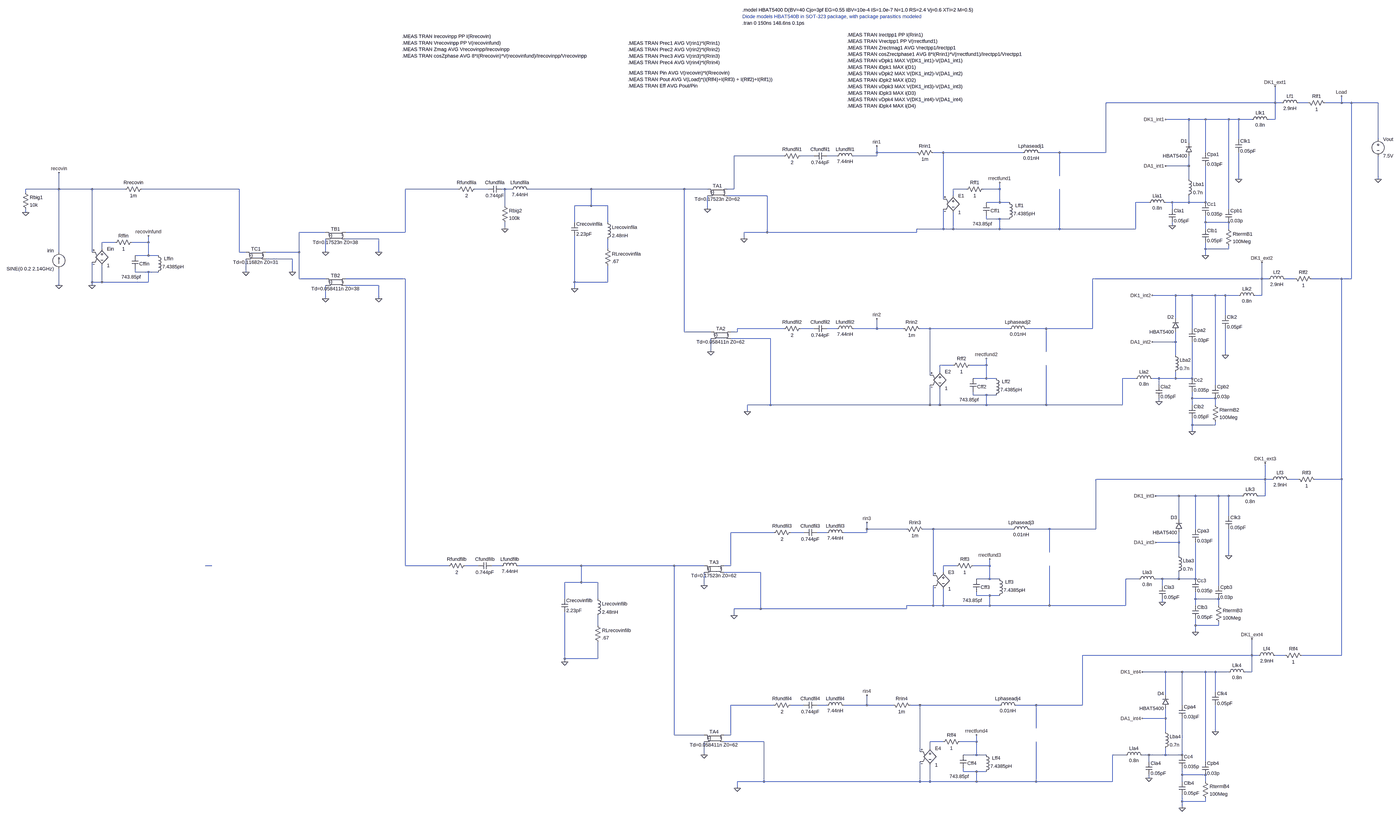
[diagram p0: schematic EnergyRecovery_TLRCN2stage_ResRec3_v2.asc, whole sheet]
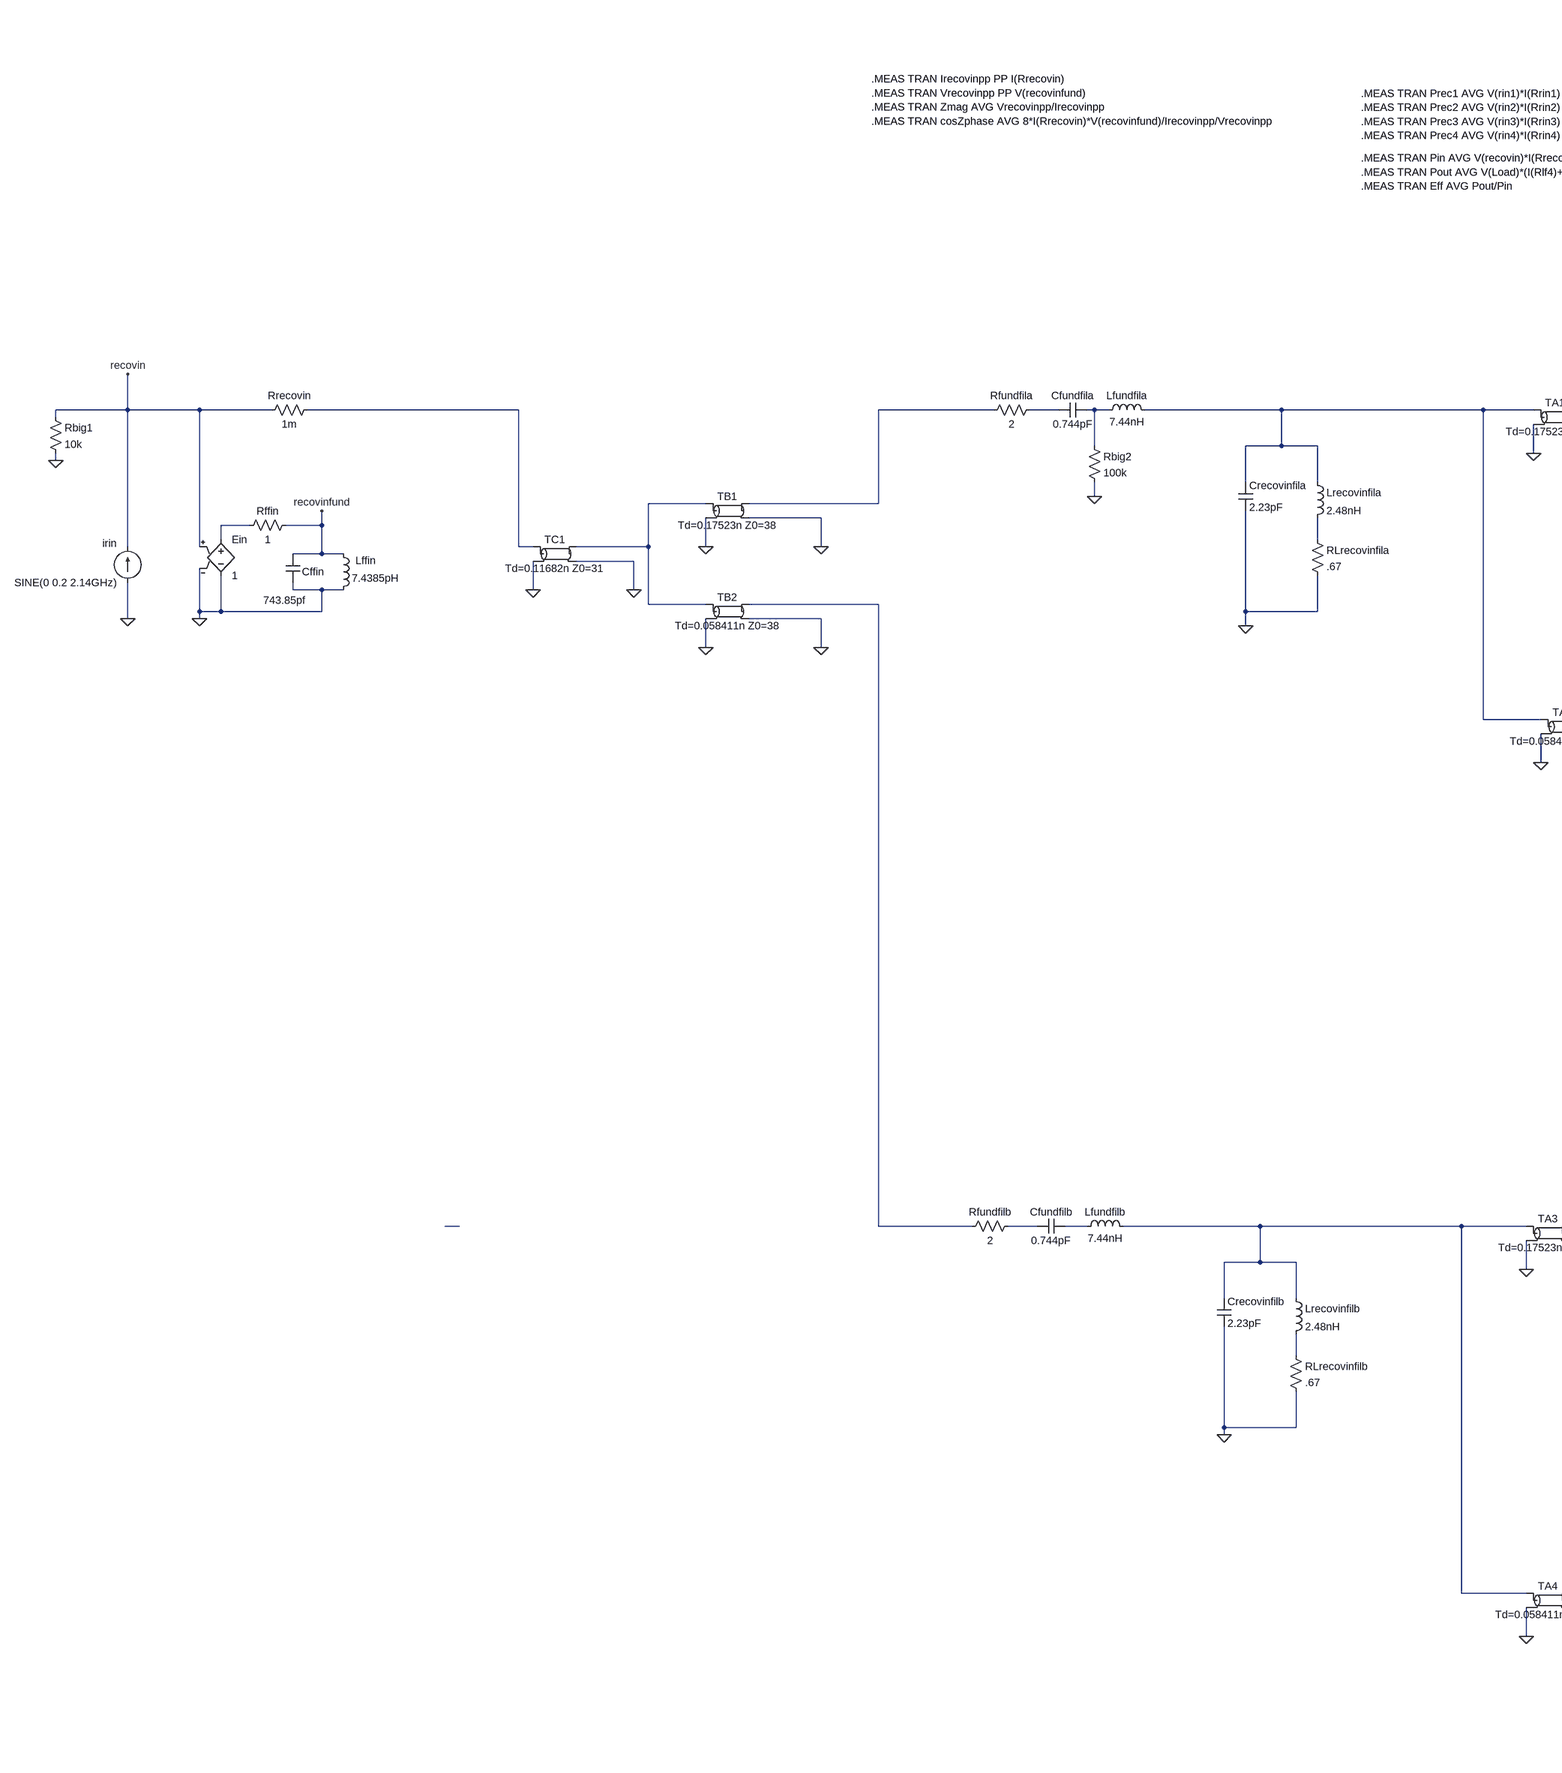
[diagram p1: schematic EnergyRecovery_TLRCN2stage_ResRec3_v2.asc, part, row 1 of 1, column 1 of 2]
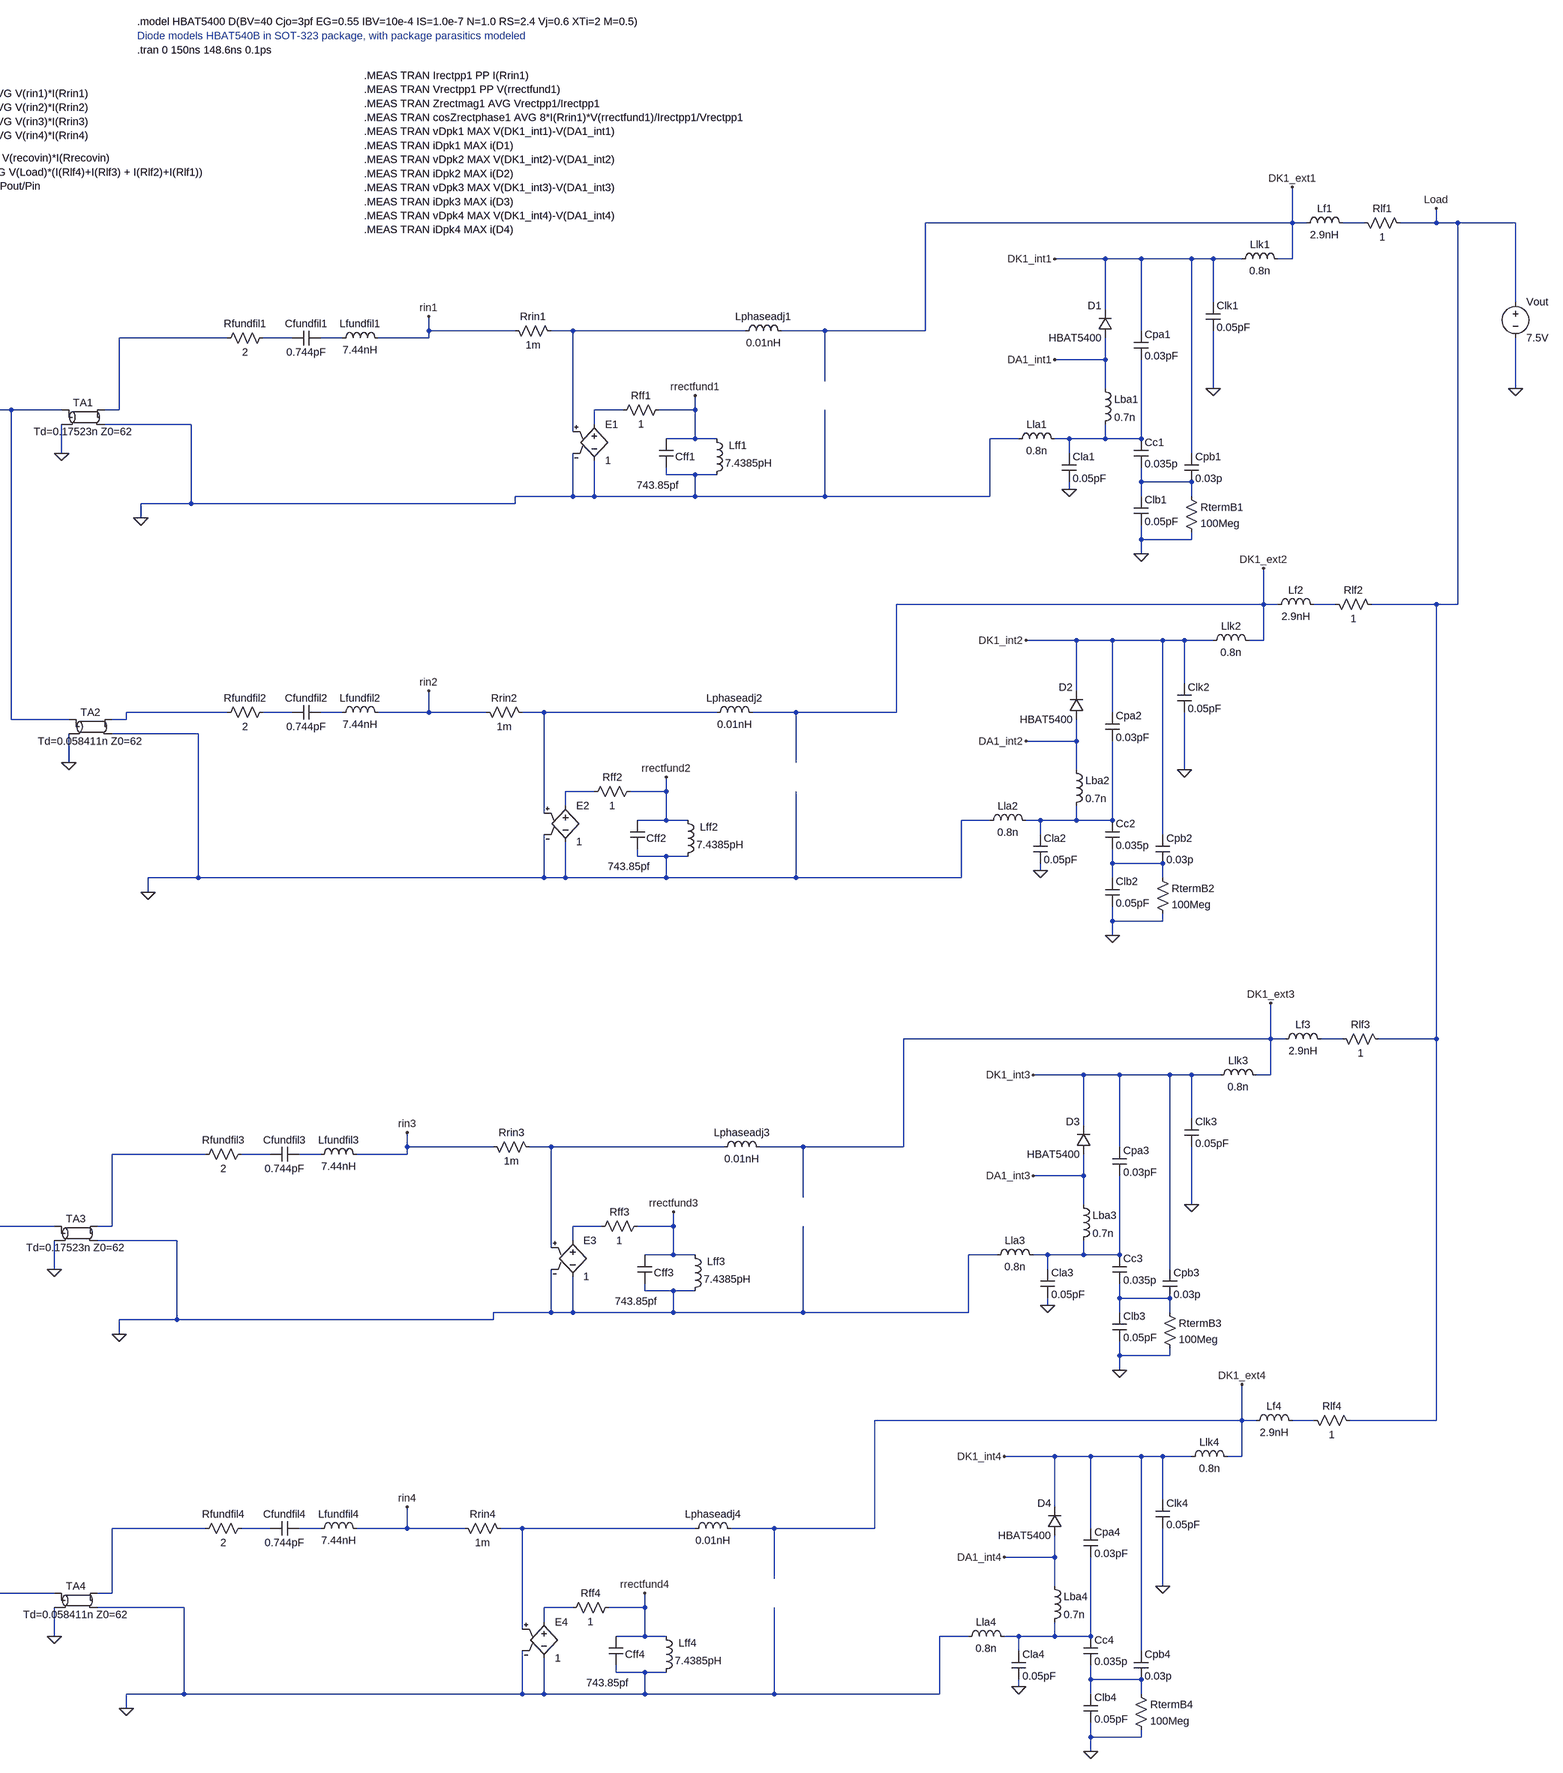
[diagram p2: schematic EnergyRecovery_TLRCN2stage_ResRec3_v2.asc, part, row 1 of 1, column 2 of 2]
EnergyRecovery_TLRCN2stage_ResRec3_v2.asc, the LTspice schematic file:
Version 4
SHEET 1 2288 2676
WIRE 1584 -784 1584 -864
WIRE 1584 -784 768 -784
WIRE 1616 -784 1584 -784
WIRE 1744 -784 1696 -784
WIRE 1904 -784 1904 -816
WIRE 1904 -784 1824 -784
WIRE 1952 -784 1904 -784
WIRE 2080 -784 1952 -784
WIRE 1168 -704 1056 -704
WIRE 1248 -704 1168 -704
WIRE 1360 -704 1248 -704
WIRE 1408 -704 1360 -704
WIRE 1472 -704 1408 -704
WIRE 1584 -704 1584 -784
WIRE 1584 -704 1552 -704
WIRE 1408 -608 1408 -704
WIRE 2080 -608 2080 -784
WIRE 1168 -592 1168 -704
WIRE -512 -544 -512 -576
WIRE -320 -544 -512 -544
WIRE -192 -544 -240 -544
WIRE 192 -544 -192 -544
WIRE 368 -544 272 -544
WIRE 768 -544 768 -784
WIRE 768 -544 368 -544
WIRE 1248 -544 1248 -704
WIRE -960 -528 -1200 -528
WIRE -816 -528 -880 -528
WIRE -704 -528 -752 -528
WIRE -512 -528 -512 -544
WIRE -512 -528 -624 -528
WIRE 1168 -480 1168 -528
WIRE 1168 -480 1056 -480
WIRE 368 -432 368 -544
WIRE 1168 -416 1168 -480
WIRE 1408 -416 1408 -544
WIRE 2080 -416 2080 -528
WIRE -4928 -368 -4928 -448
WIRE -4928 -368 -5088 -368
WIRE -4752 -368 -4928 -368
WIRE -4592 -368 -4752 -368
WIRE -3584 -368 -4512 -368
WIRE -2528 -368 -2784 -368
WIRE -2384 -368 -2448 -368
WIRE -2304 -368 -2320 -368
WIRE -2272 -368 -2304 -368
WIRE -1888 -368 -2192 -368
WIRE -1440 -368 -1888 -368
WIRE -1328 -368 -1440 -368
WIRE -1200 -368 -1200 -528
WIRE -1200 -368 -1232 -368
WIRE -80 -368 -144 -368
WIRE 80 -368 80 -400
WIRE 80 -368 0 -368
WIRE -5088 -352 -5088 -368
WIRE -1040 -336 -1232 -336
WIRE -144 -336 -144 -368
WIRE -192 -320 -192 -544
WIRE 80 -304 80 -368
WIRE 80 -304 16 -304
WIRE 128 -304 80 -304
WIRE 976 -304 912 -304
WIRE 1088 -304 1056 -304
WIRE 1168 -304 1168 -336
WIRE 1168 -304 1088 -304
WIRE 1248 -304 1248 -480
WIRE 1248 -304 1168 -304
WIRE -2304 -288 -2304 -368
WIRE -1888 -288 -1888 -368
WIRE -1888 -288 -1968 -288
WIRE -1808 -288 -1888 -288
WIRE -1328 -272 -1328 -336
WIRE 1088 -272 1088 -304
WIRE 1360 -272 1360 -704
WIRE -5088 -256 -5088 -272
WIRE 16 -224 16 -240
WIRE 80 -224 16 -224
WIRE 128 -224 80 -224
WIRE -1968 -208 -1968 -288
WIRE -1808 -208 -1808 -288
WIRE 1248 -208 1248 -240
WIRE 1360 -208 1248 -208
WIRE 1088 -192 1088 -208
WIRE -2304 -176 -2304 -208
WIRE -192 -176 -192 -272
WIRE -192 -176 -320 -176
WIRE -144 -176 -144 -256
WIRE -144 -176 -192 -176
WIRE 80 -176 80 -224
WIRE 80 -176 -144 -176
WIRE 368 -176 368 -368
WIRE 368 -176 80 -176
WIRE 912 -176 912 -304
WIRE 912 -176 368 -176
WIRE 1248 -176 1248 -208
WIRE 1360 -176 1360 -208
WIRE -3168 -160 -3296 -160
WIRE -2784 -160 -2784 -368
WIRE -2784 -160 -3072 -160
WIRE -1040 -160 -1040 -336
WIRE -1040 -160 -1152 -160
WIRE -320 -160 -320 -176
WIRE -320 -160 -1040 -160
WIRE -2912 -128 -3072 -128
WIRE -1152 -128 -1152 -160
WIRE -4640 -112 -4704 -112
WIRE -4480 -112 -4480 -144
WIRE -4480 -112 -4560 -112
WIRE -4704 -80 -4704 -112
WIRE -1808 -80 -1808 -128
WIRE 1248 -80 1248 -112
WIRE 1360 -80 1360 -96
WIRE 1360 -80 1248 -80
WIRE -4928 -64 -4928 -368
WIRE -4752 -64 -4752 -368
WIRE -3584 -64 -3584 -368
WIRE -3552 -64 -3584 -64
WIRE -3296 -64 -3296 -160
WIRE -3296 -64 -3456 -64
WIRE -3168 -64 -3168 -128
WIRE -2912 -64 -2912 -128
WIRE -4480 -48 -4480 -112
WIRE -4480 -48 -4544 -48
WIRE -4432 -48 -4480 -48
WIRE 1248 -48 1248 -80
WIRE -3328 -32 -3456 -32
WIRE -4544 32 -4544 16
WIRE -4480 32 -4544 32
WIRE -4432 32 -4480 32
WIRE -3552 32 -3552 -32
WIRE -3328 32 -3328 -32
WIRE -3296 64 -3296 -64
WIRE -3168 64 -3296 64
WIRE -2784 64 -3072 64
WIRE 1520 64 1520 -16
WIRE 1520 64 704 64
WIRE 1552 64 1520 64
WIRE 1680 64 1632 64
WIRE 1904 64 1760 64
WIRE 1952 64 1952 -784
WIRE 1952 64 1904 64
WIRE -4752 80 -4752 -16
WIRE -4704 80 -4704 0
WIRE -4704 80 -4752 80
WIRE -4480 80 -4480 32
WIRE -4480 80 -4704 80
WIRE -1968 80 -1968 -144
WIRE -1808 80 -1808 0
WIRE -1808 80 -1968 80
WIRE -4928 96 -4928 16
WIRE -4752 96 -4752 80
WIRE -2912 96 -3072 96
WIRE -1968 112 -1968 80
WIRE 1104 144 992 144
WIRE 1184 144 1104 144
WIRE 1296 144 1184 144
WIRE 1344 144 1296 144
WIRE 1408 144 1344 144
WIRE 1520 144 1520 64
WIRE 1520 144 1488 144
WIRE -3168 160 -3168 96
WIRE -2912 160 -2912 96
WIRE 1344 240 1344 144
WIRE 1104 256 1104 144
WIRE -960 304 -1184 304
WIRE -816 304 -880 304
WIRE -704 304 -752 304
WIRE -512 304 -512 256
WIRE -512 304 -624 304
WIRE -384 304 -512 304
WIRE -256 304 -304 304
WIRE 128 304 -256 304
WIRE 304 304 208 304
WIRE 704 304 704 64
WIRE 704 304 304 304
WIRE 1184 304 1184 144
WIRE -1440 320 -1440 -368
WIRE -1312 320 -1440 320
WIRE -1184 320 -1184 304
WIRE -1184 320 -1216 320
WIRE -1024 352 -1216 352
WIRE 1104 368 1104 320
WIRE 1104 368 992 368
WIRE -1312 416 -1312 352
WIRE 304 416 304 304
WIRE 1104 432 1104 368
WIRE 1344 432 1344 304
WIRE -144 480 -208 480
WIRE 16 480 16 448
WIRE 16 480 -64 480
WIRE -208 512 -208 480
WIRE -256 528 -256 304
WIRE 16 544 16 480
WIRE 16 544 -48 544
WIRE 64 544 16 544
WIRE 912 544 848 544
WIRE 1024 544 992 544
WIRE 1104 544 1104 512
WIRE 1104 544 1024 544
WIRE 1184 544 1184 368
WIRE 1184 544 1104 544
WIRE 1024 576 1024 544
WIRE 1296 576 1296 144
WIRE -48 624 -48 608
WIRE 16 624 -48 624
WIRE 64 624 16 624
WIRE 1184 640 1184 608
WIRE 1296 640 1184 640
WIRE 1024 656 1024 640
WIRE -1024 672 -1024 352
WIRE -1024 672 -1136 672
WIRE -256 672 -256 576
WIRE -256 672 -1024 672
WIRE -208 672 -208 592
WIRE -208 672 -256 672
WIRE 16 672 16 624
WIRE 16 672 -208 672
WIRE 304 672 304 480
WIRE 304 672 16 672
WIRE 848 672 848 544
WIRE 848 672 304 672
WIRE 1184 672 1184 640
WIRE 1296 672 1296 640
WIRE -1136 704 -1136 672
WIRE 1184 768 1184 736
WIRE 1296 768 1296 752
WIRE 1296 768 1184 768
WIRE 1184 800 1184 768
WIRE 1536 1072 1536 992
WIRE 1536 1072 720 1072
WIRE 1568 1072 1536 1072
WIRE 1696 1072 1648 1072
WIRE 1904 1072 1904 64
WIRE 1904 1072 1776 1072
WIRE 1120 1152 1008 1152
WIRE 1200 1152 1120 1152
WIRE 1312 1152 1200 1152
WIRE 1360 1152 1312 1152
WIRE 1424 1152 1360 1152
WIRE 1536 1152 1536 1072
WIRE 1536 1152 1504 1152
WIRE 1360 1248 1360 1152
WIRE 1120 1264 1120 1152
WIRE -560 1312 -560 1280
WIRE -368 1312 -560 1312
WIRE -240 1312 -288 1312
WIRE 144 1312 -240 1312
WIRE 320 1312 224 1312
WIRE 720 1312 720 1072
WIRE 720 1312 320 1312
WIRE 1200 1312 1200 1152
WIRE -1008 1328 -1216 1328
WIRE -864 1328 -928 1328
WIRE -752 1328 -800 1328
WIRE -560 1328 -560 1312
WIRE -560 1328 -672 1328
WIRE 1120 1376 1120 1328
WIRE 1120 1376 1008 1376
WIRE 320 1424 320 1312
WIRE 1120 1440 1120 1376
WIRE 1360 1440 1360 1312
WIRE -4096 1488 -4128 1488
WIRE -2784 1488 -2784 64
WIRE -2576 1488 -2784 1488
WIRE -2432 1488 -2496 1488
WIRE -2320 1488 -2368 1488
WIRE -1936 1488 -2240 1488
WIRE -1488 1488 -1936 1488
WIRE -1344 1488 -1488 1488
WIRE -1216 1488 -1216 1328
WIRE -1216 1488 -1248 1488
WIRE -128 1488 -192 1488
WIRE 32 1488 32 1456
WIRE 32 1488 -48 1488
WIRE -1072 1520 -1248 1520
WIRE -192 1520 -192 1488
WIRE -240 1536 -240 1312
WIRE 32 1552 32 1488
WIRE 32 1552 -32 1552
WIRE 80 1552 32 1552
WIRE 928 1552 864 1552
WIRE 1040 1552 1008 1552
WIRE 1120 1552 1120 1520
WIRE 1120 1552 1040 1552
WIRE 1200 1552 1200 1376
WIRE 1200 1552 1120 1552
WIRE -1936 1568 -1936 1488
WIRE -1936 1568 -2016 1568
WIRE -1856 1568 -1936 1568
WIRE -1344 1584 -1344 1520
WIRE 1040 1584 1040 1552
WIRE 1312 1584 1312 1152
WIRE -32 1632 -32 1616
WIRE 32 1632 -32 1632
WIRE 80 1632 32 1632
WIRE -2016 1648 -2016 1568
WIRE -1856 1648 -1856 1568
WIRE 1200 1648 1200 1616
WIRE 1312 1648 1200 1648
WIRE 1040 1664 1040 1648
WIRE -240 1680 -240 1584
WIRE -240 1680 -368 1680
WIRE -192 1680 -192 1600
WIRE -192 1680 -240 1680
WIRE 32 1680 32 1632
WIRE 32 1680 -192 1680
WIRE 320 1680 320 1488
WIRE 320 1680 32 1680
WIRE 864 1680 864 1552
WIRE 864 1680 320 1680
WIRE 1200 1680 1200 1648
WIRE 1312 1680 1312 1648
WIRE -1072 1696 -1072 1520
WIRE -1072 1696 -1200 1696
WIRE -368 1696 -368 1680
WIRE -368 1696 -1072 1696
WIRE -1200 1728 -1200 1696
WIRE -1856 1776 -1856 1728
WIRE 1200 1776 1200 1744
WIRE 1312 1776 1312 1760
WIRE 1312 1776 1200 1776
WIRE 1200 1808 1200 1776
WIRE 1472 1920 1472 1840
WIRE 1472 1920 656 1920
WIRE 1504 1920 1472 1920
WIRE 1632 1920 1584 1920
WIRE 1904 1920 1904 1072
WIRE 1904 1920 1712 1920
WIRE -2016 1936 -2016 1712
WIRE -1856 1936 -1856 1856
WIRE -1856 1936 -2016 1936
WIRE -2016 1952 -2016 1936
WIRE 1056 2000 944 2000
WIRE 1136 2000 1056 2000
WIRE 1248 2000 1136 2000
WIRE 1296 2000 1248 2000
WIRE 1360 2000 1296 2000
WIRE 1472 2000 1472 1920
WIRE 1472 2000 1440 2000
WIRE 1296 2096 1296 2000
WIRE 1056 2112 1056 2000
WIRE -1008 2160 -1216 2160
WIRE -864 2160 -928 2160
WIRE -752 2160 -800 2160
WIRE -560 2160 -560 2112
WIRE -560 2160 -672 2160
WIRE -432 2160 -560 2160
WIRE -304 2160 -352 2160
WIRE 80 2160 -304 2160
WIRE 256 2160 160 2160
WIRE 656 2160 656 1920
WIRE 656 2160 256 2160
WIRE 1136 2160 1136 2000
WIRE 1056 2224 1056 2176
WIRE 1056 2224 944 2224
WIRE 256 2272 256 2160
WIRE 1056 2288 1056 2224
WIRE 1296 2288 1296 2160
WIRE -1488 2304 -1488 1488
WIRE -1344 2304 -1488 2304
WIRE -1216 2304 -1216 2160
WIRE -1216 2304 -1248 2304
WIRE -1056 2336 -1248 2336
WIRE -192 2336 -256 2336
WIRE -32 2336 -32 2304
WIRE -32 2336 -112 2336
WIRE -256 2368 -256 2336
WIRE -304 2384 -304 2160
WIRE -1344 2400 -1344 2336
WIRE -32 2400 -32 2336
WIRE -32 2400 -96 2400
WIRE 16 2400 -32 2400
WIRE 864 2400 800 2400
WIRE 976 2400 944 2400
WIRE 1056 2400 1056 2368
WIRE 1056 2400 976 2400
WIRE 1136 2400 1136 2224
WIRE 1136 2400 1056 2400
WIRE 976 2432 976 2400
WIRE 1248 2432 1248 2000
WIRE -96 2480 -96 2464
WIRE -32 2480 -96 2480
WIRE 16 2480 -32 2480
WIRE 1136 2496 1136 2464
WIRE 1248 2496 1136 2496
WIRE 976 2512 976 2496
WIRE -1056 2528 -1056 2336
WIRE -1056 2528 -1184 2528
WIRE -304 2528 -304 2432
WIRE -304 2528 -1056 2528
WIRE -256 2528 -256 2448
WIRE -256 2528 -304 2528
WIRE -32 2528 -32 2480
WIRE -32 2528 -256 2528
WIRE 256 2528 256 2336
WIRE 256 2528 -32 2528
WIRE 800 2528 800 2400
WIRE 800 2528 256 2528
WIRE 1136 2528 1136 2496
WIRE 1248 2528 1248 2496
WIRE -1184 2560 -1184 2528
WIRE 1136 2624 1136 2592
WIRE 1248 2624 1248 2608
WIRE 1248 2624 1136 2624
WIRE 1136 2656 1136 2624
FLAG -4928 96 0
FLAG -4928 -448 recovin
FLAG -4480 -144 recovinfund
FLAG -4752 96 0
FLAG 1056 -704 DK1_int1
FLAG 1904 -816 Load
FLAG 80 -400 rrectfund1
FLAG 1408 -416 0
FLAG 1088 -192 0
FLAG 1248 -48 0
FLAG 1056 -480 DA1_int1
FLAG 1584 -864 DK1_ext1
FLAG 2080 -416 0
FLAG 992 144 DK1_int2
FLAG 16 448 rrectfund2
FLAG 1344 432 0
FLAG 1024 656 0
FLAG 1184 800 0
FLAG 992 368 DA1_int2
FLAG 1520 -16 DK1_ext2
FLAG -1152 -128 0
FLAG -1136 704 0
FLAG -512 -576 rin1
FLAG -512 256 rin2
FLAG 1008 1152 DK1_int3
FLAG 32 1456 rrectfund3
FLAG 1360 1440 0
FLAG 1040 1664 0
FLAG 1200 1808 0
FLAG 1008 1376 DA1_int3
FLAG 1536 992 DK1_ext3
FLAG 944 2000 DK1_int4
FLAG -32 2304 rrectfund4
FLAG 1296 2288 0
FLAG 976 2512 0
FLAG 1136 2656 0
FLAG 944 2224 DA1_int4
FLAG 1472 1840 DK1_ext4
FLAG -1200 1728 0
FLAG -1184 2560 0
FLAG -560 1280 rin3
FLAG -560 2112 rin4
FLAG -2016 1952 0
FLAG -1968 112 0
FLAG -5088 -256 0
FLAG -2304 -176 0
FLAG -1328 -272 0
FLAG -1312 416 0
FLAG -1344 1584 0
FLAG -1344 2400 0
FLAG -3168 -64 0
FLAG -3168 160 0
FLAG -2912 -64 0
FLAG -2912 160 0
FLAG -3328 32 0
FLAG -3552 32 0
SYMBOL current -4928 16 R180
WINDOW 0 24 88 Left 0
WINDOW 3 24 0 Left 0
WINDOW 123 0 0 Left 0
WINDOW 39 0 0 Left 0
SYMATTR InstName irin
SYMATTR Value SINE(0 0.2 2.14GHz)
SYMBOL ind -720 320 R270
WINDOW 0 32 56 VTop 0
WINDOW 3 5 56 VBottom 0
SYMATTR InstName Lfundfil2
SYMATTR Value 7.44nH
SYMBOL cap -752 288 R90
WINDOW 0 0 32 VBottom 0
WINDOW 3 32 32 VTop 0
SYMATTR InstName Cfundfil2
SYMATTR Value 0.744pF
SYMBOL res -864 288 R90
WINDOW 0 0 56 VBottom 0
WINDOW 3 32 56 VTop 0
SYMATTR InstName Rfundfil2
SYMATTR Value 2
SYMBOL ind -720 -512 R270
WINDOW 0 32 56 VTop 0
WINDOW 3 5 56 VBottom 0
SYMATTR InstName Lfundfil1
SYMATTR Value 7.44nH
SYMBOL cap -752 -544 R90
WINDOW 0 0 32 VBottom 0
WINDOW 3 32 32 VTop 0
SYMATTR InstName Cfundfil1
SYMATTR Value 0.744pF
SYMBOL res -864 -544 R90
WINDOW 0 0 56 VBottom 0
WINDOW 3 32 56 VTop 0
SYMATTR InstName Rfundfil1
SYMATTR Value 2
SYMBOL res -4608 -352 R270
WINDOW 0 32 56 VTop 0
WINDOW 3 0 56 VBottom 0
SYMATTR InstName Rrecovin
SYMATTR Value 1m
SYMBOL cap -4560 -48 R0
WINDOW 0 36 40 Left 0
WINDOW 3 -50 103 Left 0
SYMATTR InstName Cffin
SYMATTR Value 743.85pf
SYMBOL ind -4448 -64 R0
WINDOW 0 43 31 Left 0
WINDOW 3 35 70 Left 0
SYMATTR InstName Lffin
SYMATTR Value 7.4385pH
SYMBOL e -4704 -96 R0
SYMATTR InstName Ein
SYMATTR Value 1
SYMBOL res -4544 -128 R90
WINDOW 0 0 56 VBottom 0
WINDOW 3 32 56 VTop 0
SYMATTR InstName Rffin
SYMATTR Value 1
SYMBOL cap -1984 -208 R0
SYMATTR InstName Crecovinfila
SYMATTR Value 2.23pF
SYMBOL ind -1824 -224 R0
SYMATTR InstName Lrecovinfila
SYMATTR Value 2.48nH
SYMBOL res -1824 -96 R0
SYMATTR InstName RLrecovinfila
SYMATTR Value .67
SYMBOL cap 1232 -544 R0
SYMATTR InstName Cpa1
SYMATTR Value 0.03pF
SYMBOL cap 1392 -608 R0
SYMATTR InstName Clk1
SYMATTR Value 0.05pF
SYMBOL ind 1600 -768 R270
WINDOW 0 32 56 VTop 0
WINDOW 3 5 56 VBottom 0
SYMATTR InstName Lf1
SYMATTR Value 2.9nH
SYMBOL res 1728 -800 M90
WINDOW 0 0 56 VBottom 0
WINDOW 3 32 56 VTop 0
SYMATTR InstName Rlf1
SYMATTR Value 1
SYMBOL cap 0 -304 R0
WINDOW 0 36 40 Left 0
WINDOW 3 -50 103 Left 0
SYMATTR InstName Cff1
SYMATTR Value 743.85pf
SYMBOL ind 112 -320 R0
WINDOW 0 43 31 Left 0
WINDOW 3 35 70 Left 0
SYMATTR InstName Lff1
SYMATTR Value 7.4385pH
SYMBOL e -144 -352 R0
SYMATTR InstName E1
SYMATTR Value 1
SYMBOL res 16 -384 R90
WINDOW 0 0 56 VBottom 0
WINDOW 3 32 56 VTop 0
SYMATTR InstName Rff1
SYMATTR Value 1
SYMBOL voltage 2080 -624 R0
SYMATTR InstName Vout
SYMATTR Value 7.5V
SYMBOL res -336 -560 M90
WINDOW 0 0 56 VBottom 0
WINDOW 3 32 56 VTop 0
SYMATTR InstName Rrin1
SYMATTR Value 1m
SYMBOL ind 176 -528 R270
WINDOW 0 32 56 VTop 0
WINDOW 3 5 56 VBottom 0
SYMATTR InstName Lphaseadj1
SYMATTR Value 0.01nH
SYMBOL diode 1184 -528 R180
WINDOW 0 24 72 Left 0
WINDOW 3 24 0 Left 0
SYMATTR InstName D1
SYMATTR Value HBAT5400
SYMBOL ind 1152 -432 R0
SYMATTR InstName Lba1
SYMATTR Value 0.7n
SYMBOL ind 1456 -688 R270
WINDOW 0 32 56 VTop 0
WINDOW 3 5 56 VBottom 0
SYMATTR InstName Llk1
SYMATTR Value 0.8n
SYMBOL cap 1072 -272 R0
SYMATTR InstName Cla1
SYMATTR Value 0.05pF
SYMBOL cap 1232 -304 R0
SYMATTR InstName Cc1
SYMATTR Value 0.035p
SYMBOL cap 1232 -176 R0
SYMATTR InstName Clb1
SYMATTR Value 0.05pF
SYMBOL cap 1344 -272 R0
SYMATTR InstName Cpb1
SYMATTR Value 0.03p
SYMBOL ind 960 -288 R270
WINDOW 0 32 56 VTop 0
WINDOW 3 5 56 VBottom 0
SYMATTR InstName Lla1
SYMATTR Value 0.8n
SYMBOL res 1344 -192 R0
SYMATTR InstName RtermB1
SYMATTR Value 100Meg
SYMBOL cap 1168 304 R0
SYMATTR InstName Cpa2
SYMATTR Value 0.03pF
SYMBOL cap 1328 240 R0
SYMATTR InstName Clk2
SYMATTR Value 0.05pF
SYMBOL ind 1536 80 R270
WINDOW 0 32 56 VTop 0
WINDOW 3 5 56 VBottom 0
SYMATTR InstName Lf2
SYMATTR Value 2.9nH
SYMBOL res 1664 48 M90
WINDOW 0 0 56 VBottom 0
WINDOW 3 32 56 VTop 0
SYMATTR InstName Rlf2
SYMATTR Value 1
SYMBOL cap -64 544 R0
WINDOW 0 36 40 Left 0
WINDOW 3 -50 103 Left 0
SYMATTR InstName Cff2
SYMATTR Value 743.85pf
SYMBOL ind 48 528 R0
WINDOW 0 43 31 Left 0
WINDOW 3 35 70 Left 0
SYMATTR InstName Lff2
SYMATTR Value 7.4385pH
SYMBOL e -208 496 R0
SYMATTR InstName E2
SYMATTR Value 1
SYMBOL res -48 464 R90
WINDOW 0 0 56 VBottom 0
WINDOW 3 32 56 VTop 0
SYMATTR InstName Rff2
SYMATTR Value 1
SYMBOL res -400 288 M90
WINDOW 0 0 56 VBottom 0
WINDOW 3 32 56 VTop 0
SYMATTR InstName Rrin2
SYMATTR Value 1m
SYMBOL ind 112 320 R270
WINDOW 0 32 56 VTop 0
WINDOW 3 5 56 VBottom 0
SYMATTR InstName Lphaseadj2
SYMATTR Value 0.01nH
SYMBOL diode 1120 320 R180
WINDOW 0 24 72 Left 0
WINDOW 3 24 0 Left 0
SYMATTR InstName D2
SYMATTR Value HBAT5400
SYMBOL ind 1088 416 R0
SYMATTR InstName Lba2
SYMATTR Value 0.7n
SYMBOL ind 1392 160 R270
WINDOW 0 32 56 VTop 0
WINDOW 3 5 56 VBottom 0
SYMATTR InstName Llk2
SYMATTR Value 0.8n
SYMBOL cap 1008 576 R0
SYMATTR InstName Cla2
SYMATTR Value 0.05pF
SYMBOL cap 1168 544 R0
SYMATTR InstName Cc2
SYMATTR Value 0.035p
SYMBOL cap 1168 672 R0
SYMATTR InstName Clb2
SYMATTR Value 0.05pF
SYMBOL cap 1280 576 R0
SYMATTR InstName Cpb2
SYMATTR Value 0.03p
SYMBOL ind 896 560 R270
WINDOW 0 32 56 VTop 0
WINDOW 3 5 56 VBottom 0
SYMATTR InstName Lla2
SYMATTR Value 0.8n
SYMBOL res 1280 656 R0
SYMATTR InstName RtermB2
SYMATTR Value 100Meg
SYMBOL ind -768 2176 R270
WINDOW 0 32 56 VTop 0
WINDOW 3 5 56 VBottom 0
SYMATTR InstName Lfundfil4
SYMATTR Value 7.44nH
SYMBOL cap -800 2144 R90
WINDOW 0 0 32 VBottom 0
WINDOW 3 32 32 VTop 0
SYMATTR InstName Cfundfil4
SYMATTR Value 0.744pF
SYMBOL res -912 2144 R90
WINDOW 0 0 56 VBottom 0
WINDOW 3 32 56 VTop 0
SYMATTR InstName Rfundfil4
SYMATTR Value 2
SYMBOL ind -768 1344 R270
WINDOW 0 32 56 VTop 0
WINDOW 3 5 56 VBottom 0
SYMATTR InstName Lfundfil3
SYMATTR Value 7.44nH
SYMBOL cap -800 1312 R90
WINDOW 0 0 32 VBottom 0
WINDOW 3 32 32 VTop 0
SYMATTR InstName Cfundfil3
SYMATTR Value 0.744pF
SYMBOL res -912 1312 R90
WINDOW 0 0 56 VBottom 0
WINDOW 3 32 56 VTop 0
SYMATTR InstName Rfundfil3
SYMATTR Value 2
SYMBOL cap 1184 1312 R0
SYMATTR InstName Cpa3
SYMATTR Value 0.03pF
SYMBOL cap 1344 1248 R0
SYMATTR InstName Clk3
SYMATTR Value 0.05pF
SYMBOL ind 1552 1088 R270
WINDOW 0 32 56 VTop 0
WINDOW 3 5 56 VBottom 0
SYMATTR InstName Lf3
SYMATTR Value 2.9nH
SYMBOL res 1680 1056 M90
WINDOW 0 0 56 VBottom 0
WINDOW 3 32 56 VTop 0
SYMATTR InstName Rlf3
SYMATTR Value 1
SYMBOL cap -48 1552 R0
WINDOW 0 36 40 Left 0
WINDOW 3 -50 103 Left 0
SYMATTR InstName Cff3
SYMATTR Value 743.85pf
SYMBOL ind 64 1536 R0
WINDOW 0 43 31 Left 0
WINDOW 3 35 70 Left 0
SYMATTR InstName Lff3
SYMATTR Value 7.4385pH
SYMBOL e -192 1504 R0
SYMATTR InstName E3
SYMATTR Value 1
SYMBOL res -32 1472 R90
WINDOW 0 0 56 VBottom 0
WINDOW 3 32 56 VTop 0
SYMATTR InstName Rff3
SYMATTR Value 1
SYMBOL res -384 1296 M90
WINDOW 0 0 56 VBottom 0
WINDOW 3 32 56 VTop 0
SYMATTR InstName Rrin3
SYMATTR Value 1m
SYMBOL ind 128 1328 R270
WINDOW 0 32 56 VTop 0
WINDOW 3 5 56 VBottom 0
SYMATTR InstName Lphaseadj3
SYMATTR Value 0.01nH
SYMBOL diode 1136 1328 R180
WINDOW 0 24 72 Left 0
WINDOW 3 24 0 Left 0
SYMATTR InstName D3
SYMATTR Value HBAT5400
SYMBOL ind 1104 1424 R0
SYMATTR InstName Lba3
SYMATTR Value 0.7n
SYMBOL ind 1408 1168 R270
WINDOW 0 32 56 VTop 0
WINDOW 3 5 56 VBottom 0
SYMATTR InstName Llk3
SYMATTR Value 0.8n
SYMBOL cap 1024 1584 R0
SYMATTR InstName Cla3
SYMATTR Value 0.05pF
SYMBOL cap 1184 1552 R0
SYMATTR InstName Cc3
SYMATTR Value 0.035p
SYMBOL cap 1184 1680 R0
SYMATTR InstName Clb3
SYMATTR Value 0.05pF
SYMBOL cap 1296 1584 R0
SYMATTR InstName Cpb3
SYMATTR Value 0.03p
SYMBOL ind 912 1568 R270
WINDOW 0 32 56 VTop 0
WINDOW 3 5 56 VBottom 0
SYMATTR InstName Lla3
SYMATTR Value 0.8n
SYMBOL res 1296 1664 R0
SYMATTR InstName RtermB3
SYMATTR Value 100Meg
SYMBOL cap 1120 2160 R0
SYMATTR InstName Cpa4
SYMATTR Value 0.03pF
SYMBOL cap 1280 2096 R0
SYMATTR InstName Clk4
SYMATTR Value 0.05pF
SYMBOL ind 1488 1936 R270
WINDOW 0 32 56 VTop 0
WINDOW 3 5 56 VBottom 0
SYMATTR InstName Lf4
SYMATTR Value 2.9nH
SYMBOL res 1616 1904 M90
WINDOW 0 0 56 VBottom 0
WINDOW 3 32 56 VTop 0
SYMATTR InstName Rlf4
SYMATTR Value 1
SYMBOL cap -112 2400 R0
WINDOW 0 36 40 Left 0
WINDOW 3 -50 103 Left 0
SYMATTR InstName Cff4
SYMATTR Value 743.85pf
SYMBOL ind 0 2384 R0
WINDOW 0 43 31 Left 0
WINDOW 3 35 70 Left 0
SYMATTR InstName Lff4
SYMATTR Value 7.4385pH
SYMBOL e -256 2352 R0
SYMATTR InstName E4
SYMATTR Value 1
SYMBOL res -96 2320 R90
WINDOW 0 0 56 VBottom 0
WINDOW 3 32 56 VTop 0
SYMATTR InstName Rff4
SYMATTR Value 1
SYMBOL res -448 2144 M90
WINDOW 0 0 56 VBottom 0
WINDOW 3 32 56 VTop 0
SYMATTR InstName Rrin4
SYMATTR Value 1m
SYMBOL ind 64 2176 R270
WINDOW 0 32 56 VTop 0
WINDOW 3 5 56 VBottom 0
SYMATTR InstName Lphaseadj4
SYMATTR Value 0.01nH
SYMBOL diode 1072 2176 R180
WINDOW 0 24 72 Left 0
WINDOW 3 24 0 Left 0
SYMATTR InstName D4
SYMATTR Value HBAT5400
SYMBOL ind 1040 2272 R0
SYMATTR InstName Lba4
SYMATTR Value 0.7n
SYMBOL ind 1344 2016 R270
WINDOW 0 32 56 VTop 0
WINDOW 3 5 56 VBottom 0
SYMATTR InstName Llk4
SYMATTR Value 0.8n
SYMBOL cap 960 2432 R0
SYMATTR InstName Cla4
SYMATTR Value 0.05pF
SYMBOL cap 1120 2400 R0
SYMATTR InstName Cc4
SYMATTR Value 0.035p
SYMBOL cap 1120 2528 R0
SYMATTR InstName Clb4
SYMATTR Value 0.05pF
SYMBOL cap 1232 2432 R0
SYMATTR InstName Cpb4
SYMATTR Value 0.03p
SYMBOL ind 848 2416 R270
WINDOW 0 32 56 VTop 0
WINDOW 3 5 56 VBottom 0
SYMATTR InstName Lla4
SYMATTR Value 0.8n
SYMBOL res 1232 2512 R0
SYMATTR InstName RtermB4
SYMATTR Value 100Meg
SYMBOL cap -2032 1648 R0
SYMATTR InstName Crecovinfilb
SYMATTR Value 2.23pF
SYMBOL ind -1872 1632 R0
SYMATTR InstName Lrecovinfilb
SYMATTR Value 2.48nH
SYMBOL res -1872 1760 R0
SYMATTR InstName RLrecovinfilb
SYMATTR Value .67
SYMBOL ind -2288 -352 R270
WINDOW 0 32 56 VTop 0
WINDOW 3 5 56 VBottom 0
SYMATTR InstName Lfundfila
SYMATTR Value 7.44nH
SYMBOL cap -2320 -384 R90
WINDOW 0 0 32 VBottom 0
WINDOW 3 32 32 VTop 0
SYMATTR InstName Cfundfila
SYMATTR Value 0.744pF
SYMBOL res -2432 -384 R90
WINDOW 0 0 56 VBottom 0
WINDOW 3 32 56 VTop 0
SYMATTR InstName Rfundfila
SYMATTR Value 2
SYMBOL ind -2336 1504 R270
WINDOW 0 32 56 VTop 0
WINDOW 3 5 56 VBottom 0
SYMATTR InstName Lfundfilb
SYMATTR Value 7.44nH
SYMBOL cap -2368 1472 R90
WINDOW 0 0 32 VBottom 0
WINDOW 3 32 32 VTop 0
SYMATTR InstName Cfundfilb
SYMATTR Value 0.744pF
SYMBOL res -2480 1472 R90
WINDOW 0 0 56 VBottom 0
WINDOW 3 32 56 VTop 0
SYMATTR InstName Rfundfilb
SYMATTR Value 2
SYMBOL res -5104 -368 R0
SYMATTR InstName Rbig1
SYMATTR Value 10k
SYMBOL res -2320 -304 R0
SYMATTR InstName Rbig2
SYMATTR Value 100k
SYMBOL tline -1280 -352 R0
SYMATTR InstName TA1
SYMATTR Value Td=0.17523n Z0=62
SYMBOL tline -1264 336 R0
SYMATTR InstName TA2
SYMATTR Value Td=0.058411n Z0=62
SYMBOL tline -1296 1504 R0
SYMATTR InstName TA3
SYMATTR Value Td=0.17523n Z0=62
SYMBOL tline -1296 2320 R0
SYMATTR InstName TA4
SYMATTR Value Td=0.058411n Z0=62
SYMBOL tline -3120 -144 R0
SYMATTR InstName TB1
SYMATTR Value Td=0.17523n Z0=38
SYMBOL tline -3120 80 R0
SYMATTR InstName TB2
SYMATTR Value Td=0.058411n Z0=38
SYMBOL tline -3504 -48 R0
SYMATTR InstName TC1
SYMATTR Value Td=0.11682n Z0=31
TEXT -1160 -1168 Left 0 !.tran 0 150ns 148.6ns 0.1ps
TEXT -1712 -1072 Left 0 !.MEAS TRAN Prec1 AVG V(rin1)*I(Rrin1)\n.MEAS TRAN Prec2 AVG V(rin2)*I(Rrin2)\n.MEAS TRAN Prec3 AVG V(rin3)*I(Rrin3)\n.MEAS TRAN Prec4 AVG V(rin4)*I(Rrin4)
TEXT -1712 -928 Left 0 !.MEAS TRAN Pin AVG V(recovin)*I(Rrecovin)\n.MEAS TRAN Pout AVG V(Load)*(I(Rlf4)+I(Rlf3) + I(Rlf2)+I(Rlf1))\n.MEAS TRAN Eff AVG Pout/Pin
TEXT -656 -1112 Left 0 !.MEAS TRAN Irectpp1 PP I(Rrin1)\n.MEAS TRAN Vrectpp1 PP V(rrectfund1)\n.MEAS TRAN Zrectmag1 AVG Vrectpp1/Irectpp1\n.MEAS TRAN cosZrectphase1 AVG 8*I(Rrin1)*V(rrectfund1)/Irectpp1/Vrectpp1\n.MEAS TRAN vDpk1 MAX V(DK1_int1)-V(DA1_int1)\n.MEAS TRAN iDpk1 MAX i(D1)\n.MEAS TRAN vDpk2 MAX V(DK1_int2)-V(DA1_int2)\n.MEAS TRAN iDpk2 MAX i(D2)\n.MEAS TRAN vDpk3 MAX V(DK1_int3)-V(DA1_int3)\n.MEAS TRAN iDpk3 MAX i(D3)\n.MEAS TRAN vDpk4 MAX V(DK1_int4)-V(DA1_int4)\n.MEAS TRAN iDpk4 MAX i(D4)
TEXT -1160 -1200 Left 0 ;Diode models HBAT540B in SOT-323 package, with package parasitics modeled
TEXT -2800 -1104 Left 0 !.MEAS TRAN Irecovinpp PP I(Rrecovin)\n.MEAS TRAN Vrecovinpp PP V(recovinfund)\n.MEAS TRAN Zmag AVG Vrecovinpp/Irecovinpp\n.MEAS TRAN cosZphase AVG 8*I(Rrecovin)*V(recovinfund)/Irecovinpp/Vrecovinpp
TEXT -1160 -1232 Left 0 !.model HBAT5400 D(BV=40 Cjo=3pf EG=0.55 IBV=10e-4 IS=1.0e-7 N=1.0 RS=2.4 Vj=0.6 XTi=2 M=0.5)

The netlist it stands for:
* EnergyRecovery_TLRCN2stage_ResRec3_v2.asc
irin 0 recovin SINE(0 0.2 2.14GHz)
Lfundfil2 N021 rin2 7.44nH
Cfundfil2 N021 N020 0.744pF
Rfundfil2 N020 N019 2
Lfundfil1 N005 rin1 7.44nH
Cfundfil1 N005 N004 0.744pF
Rfundfil1 N004 N003 2
Rrecovin recovin N006 1m
Cffin recovinfund 0 743.85pf
Lffin recovinfund 0 7.4385pH
Ein N015 0 recovin 0 1
Rffin recovinfund N015 1
Crecovinfila N010 0 2.23pF
Lrecovinfila N010 N016 2.48nH
RLrecovinfila N016 0 .67
Cpa1 DK1_int1 N012 0.03pF
Clk1 DK1_int1 0 0.05pF
Lf1 DK1_ext1 N001 2.9nH
Rlf1 N001 Load 1
Cff1 rrectfund1 0 743.85pf
Lff1 rrectfund1 0 7.4385pH
E1 N011 0 N002 0 1
Rff1 rrectfund1 N011 1
Vout Load 0 7.5V
Rrin1 rin1 N002 1m
Lphaseadj1 N002 DK1_ext1 0.01nH
D1 DA1_int1 DK1_int1 HBAT5400
Lba1 DA1_int1 N012 0.7n
Llk1 DK1_int1 DK1_ext1 0.8n
Cla1 N012 0 0.05pF
Cc1 N012 N013 0.035p
Clb1 N013 0 0.05pF
Cpb1 DK1_int1 N013 0.03p
Lla1 0 N012 0.8n
RtermB1 N013 0 100Meg
Cpa2 DK1_int2 N024 0.03pF
Clk2 DK1_int2 0 0.05pF
Lf2 DK1_ext2 N018 2.9nH
Rlf2 N018 Load 1
Cff2 rrectfund2 0 743.85pf
Lff2 rrectfund2 0 7.4385pH
E2 N023 0 N022 0 1
Rff2 rrectfund2 N023 1
Rrin2 rin2 N022 1m
Lphaseadj2 N022 DK1_ext2 0.01nH
D2 DA1_int2 DK1_int2 HBAT5400
Lba2 DA1_int2 N024 0.7n
Llk2 DK1_int2 DK1_ext2 0.8n
Cla2 N024 0 0.05pF
Cc2 N024 N025 0.035p
Clb2 N025 0 0.05pF
Cpb2 DK1_int2 N025 0.03p
Lla2 0 N024 0.8n
RtermB2 N025 0 100Meg
Lfundfil4 N042 rin4 7.44nH
Cfundfil4 N042 N041 0.744pF
Rfundfil4 N041 N040 2
Lfundfil3 N030 rin3 7.44nH
Cfundfil3 N030 N029 0.744pF
Rfundfil3 N029 N028 2
Cpa3 DK1_int3 N036 0.03pF
Clk3 DK1_int3 0 0.05pF
Lf3 DK1_ext3 N026 2.9nH
Rlf3 N026 Load 1
Cff3 rrectfund3 0 743.85pf
Lff3 rrectfund3 0 7.4385pH
E3 N035 0 N027 0 1
Rff3 rrectfund3 N035 1
Rrin3 rin3 N027 1m
Lphaseadj3 N027 DK1_ext3 0.01nH
D3 DA1_int3 DK1_int3 HBAT5400
Lba3 DA1_int3 N036 0.7n
Llk3 DK1_int3 DK1_ext3 0.8n
Cla3 N036 0 0.05pF
Cc3 N036 N037 0.035p
Clb3 N037 0 0.05pF
Cpb3 DK1_int3 N037 0.03p
Lla3 0 N036 0.8n
RtermB3 N037 0 100Meg
Cpa4 DK1_int4 N045 0.03pF
Clk4 DK1_int4 0 0.05pF
Lf4 DK1_ext4 N039 2.9nH
Rlf4 N039 Load 1
Cff4 rrectfund4 0 743.85pf
Lff4 rrectfund4 0 7.4385pH
E4 N044 0 N043 0 1
Rff4 rrectfund4 N044 1
Rrin4 rin4 N043 1m
Lphaseadj4 N043 DK1_ext4 0.01nH
D4 DA1_int4 DK1_int4 HBAT5400
Lba4 DA1_int4 N045 0.7n
Llk4 DK1_int4 DK1_ext4 0.8n
Cla4 N045 0 0.05pF
Cc4 N045 N046 0.035p
Clb4 N046 0 0.05pF
Cpb4 DK1_int4 N046 0.03p
Lla4 0 N045 0.8n
RtermB4 N046 0 100Meg
Crecovinfilb N034 0 2.23pF
Lrecovinfilb N034 N038 2.48nH
RLrecovinfilb N038 0 .67
Lfundfila N009 N010 7.44nH
Cfundfila N009 N008 0.744pF
Rfundfila N008 N007 2
Lfundfilb N033 N034 7.44nH
Cfundfilb N033 N032 0.744pF
Rfundfilb N032 N017 2
Rbig1 recovin 0 10k
Rbig2 N009 0 100k
TA1 N010 0 N003 0 Td=0.17523n Z0=62
TA2 N010 0 N019 0 Td=0.058411n Z0=62
TA3 N034 0 N028 0 Td=0.17523n Z0=62
TA4 N034 0 N040 0 Td=0.058411n Z0=62
TB1 N014 0 N007 0 Td=0.17523n Z0=38
TB2 N014 0 N017 0 Td=0.058411n Z0=38
TC1 N006 0 N014 0 Td=0.11682n Z0=31
.model D D
.lib standard.dio
.tran 0 150ns 148.6ns 0.1ps
.MEAS TRAN Prec1 AVG V(rin1)*I(Rrin1)
.MEAS TRAN Prec2 AVG V(rin2)*I(Rrin2)
.MEAS TRAN Prec3 AVG V(rin3)*I(Rrin3)
.MEAS TRAN Prec4 AVG V(rin4)*I(Rrin4)
.MEAS TRAN Pin AVG V(recovin)*I(Rrecovin)
.MEAS TRAN Pout AVG V(Load)*(I(Rlf4)+I(Rlf3) + I(Rlf2)+I(Rlf1))
.MEAS TRAN Eff AVG Pout/Pin
.MEAS TRAN Irectpp1 PP I(Rrin1)
.MEAS TRAN Vrectpp1 PP V(rrectfund1)
.MEAS TRAN Zrectmag1 AVG Vrectpp1/Irectpp1
.MEAS TRAN cosZrectphase1 AVG 8*I(Rrin1)*V(rrectfund1)/Irectpp1/Vrectpp1
.MEAS TRAN vDpk1 MAX V(DK1_int1)-V(DA1_int1)
.MEAS TRAN iDpk1 MAX i(D1)
.MEAS TRAN vDpk2 MAX V(DK1_int2)-V(DA1_int2)
.MEAS TRAN iDpk2 MAX i(D2)
.MEAS TRAN vDpk3 MAX V(DK1_int3)-V(DA1_int3)
.MEAS TRAN iDpk3 MAX i(D3)
.MEAS TRAN vDpk4 MAX V(DK1_int4)-V(DA1_int4)
.MEAS TRAN iDpk4 MAX i(D4)
* Diode models HBAT540B in SOT-323 package, with package parasitics modeled
.MEAS TRAN Irecovinpp PP I(Rrecovin)
.MEAS TRAN Vrecovinpp PP V(recovinfund)
.MEAS TRAN Zmag AVG Vrecovinpp/Irecovinpp
.MEAS TRAN cosZphase AVG 8*I(Rrecovin)*V(recovinfund)/Irecovinpp/Vrecovinpp
.model HBAT5400 D(BV=40 Cjo=3pf EG=0.55 IBV=10e-4 IS=1.0e-7 N=1.0 RS=2.4 Vj=0.6 XTi=2 M=0.5)
.backanno
.end